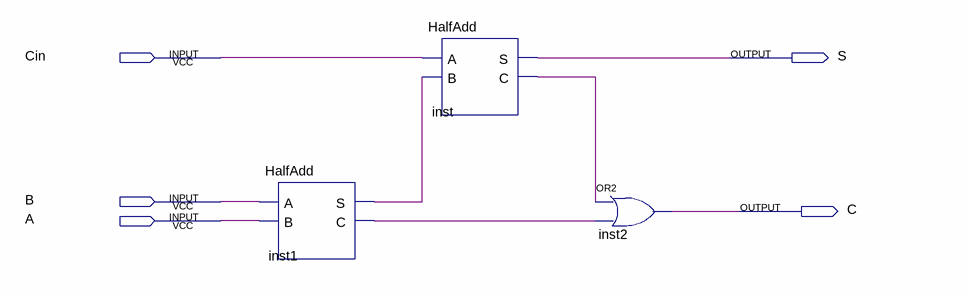
[diagram p0: schematic sheet]
// Quartus schematic FullAdd.bdf as structural Verilog: 3 symbols, 5 pins
module FullAdd (
  input  Cin,
  input  B,
  input  A,
  output S,
  output C
);

  wire inst1_c, inst1_s, inst_c;

  HalfAdd inst1 (.A(B), .B(A), .S(inst1_s), .C(inst1_c));
  HalfAdd inst (.A(Cin), .B(inst1_s), .S(S), .C(inst_c));
  or inst2 (C, inst_c, inst1_c);
endmodule
